# Altium schematic sheet Top_Level.SchDoc: Top Level
size 292 x 193 mm; SheetNumber: 3; SheetTotal: 11; SheetSize: A4
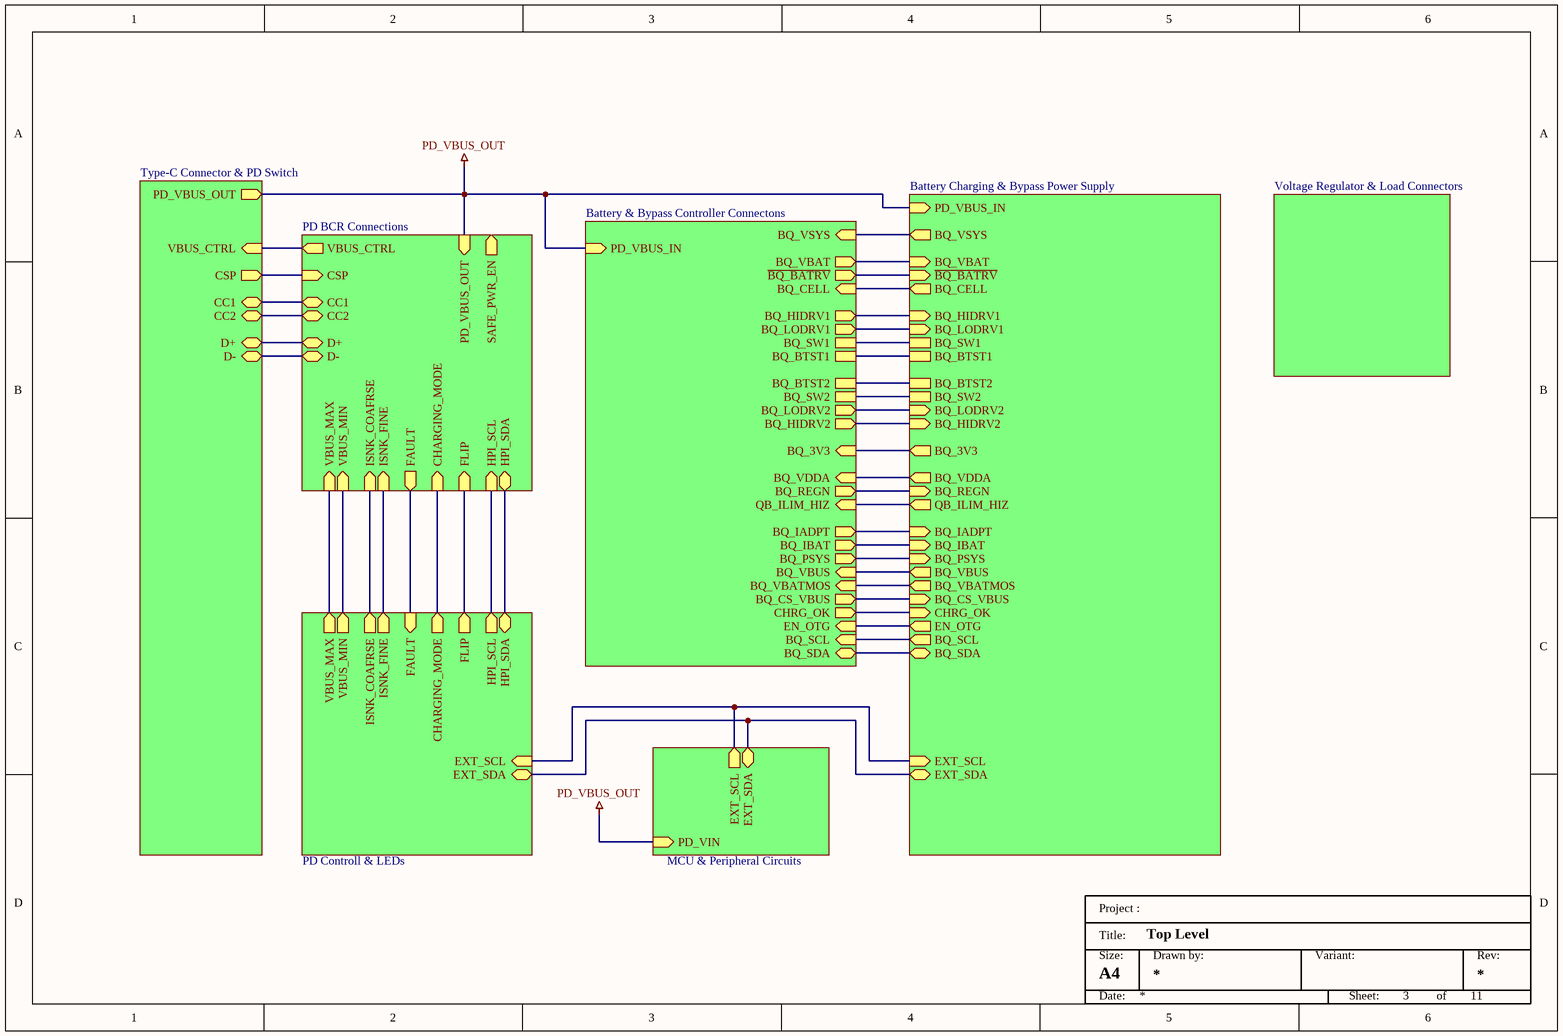
[diagram p0: Top_Level.SchDoc]

## Sub-sheets
Battery & Bypass Controller Connectons = Battery_and_Bypass_Controller_Connectons.SchDoc: CHRG_OK (out), EN_OTG (in), PD_VBUS_IN (in), BQ_3V3 (in), BQ_VDDA (in), QB_ILIM_HIZ (in), BQ_VBUS (in), BQ_IADPT (out), BQ_IBAT (out), BQ_PSYS (out), BQ_REGN (out), BQ_CS_VBUS (out), BQ_HIDRV1 (out), BQ_HIDRV2 (out), BQ_BTST1, BQ_BTST2, BQ_LODRV1 (out), BQ_LODRV2 (out), BQ_SW1, BQ_SW2, BQ_VBAT (out), ~{BQ_BATRV} (out), BQ_VBATMOS (in), BQ_CELL (in), BQ_SDA (bidir), BQ_SCL (in), BQ_VSYS (in)
Battery Charging & Bypass Power Supply = Battery_Charging_and_Bypass_Power_Supply.SchDoc: EXT_SCL (in), EXT_SDA (bidir), BQ_3V3 (out), BQ_VBAT (in), BQ_SCL (out), CHRG_OK (in), EN_OTG (out), QB_ILIM_HIZ (out), PD_VBUS_IN (in), BQ_IADPT (in), BQ_IBAT (in), BQ_PSYS (in), BQ_REGN (in), ~{BQ_BATRV} (in), BQ_VBATMOS (out), BQ_CELL (out), BQ_SDA (bidir), BQ_VDDA (out), BQ_CS_VBUS (in), BQ_HIDRV1 (in), BQ_LODRV1 (in), BQ_SW1, BQ_BTST1, BQ_BTST2, BQ_SW2, BQ_LODRV2 (in), BQ_HIDRV2 (in), BQ_VSYS (out), BQ_VBUS (out)
MCU & Peripheral Circuits = MCU_and_Peripheral_Circuits.SchDoc: EXT_SDA (bidir), PD_VIN (in), EXT_SCL (out)
PD BCR Connections = PD_BCR_Connections.SchDoc: CC1 (bidir), CC2 (bidir), CSP (in), VBUS_CTRL (out), FAULT (out), CHARGING_MODE (in), FLIP (in), VBUS_MAX (in), VBUS_MIN (in), ISNK_FINE (in), ISNK_COAFRSE (in), HPI_SCL (in), HPI_SDA (bidir), D+ (bidir), D- (bidir), PD_VBUS_OUT (in), SAFE_PWR_EN (out)
PD Controll & LEDs = PD_Controll_and_LEDs.SchDoc: CHARGING_MODE (out), EXT_SCL (in), EXT_SDA (bidir), FLIP (out), HPI_SCL (out), HPI_SDA (bidir), VBUS_MAX (out), VBUS_MIN (out), ISNK_FINE (out), ISNK_COAFRSE (out), FAULT (in)
Type-C Connector & PD Switch = Type-C_Connector_and_PD_Switch.SchDoc: D+ (bidir), D- (bidir), CC1 (bidir), CC2 (bidir), VBUS_CTRL (in), PD_VBUS_OUT (out), CSP (out)
Voltage Regulator & Load Connectors = Voltage_Regulator_and_Load_Connectors.SchDoc: no entries

## Nets
PD_VBUS_OUT: sheet MCU & Peripheral Circuits/PD_VIN, sheet Type-C Connector & PD Switch/PD_VBUS_OUT, sheet PD BCR Connections/PD_VBUS_OUT, sheet Battery & Bypass Controller Connectons/PD_VBUS_IN, sheet Battery Charging & Bypass Power Supply/PD_VBUS_IN
(unnamed): sheet PD Controll & LEDs/CHARGING_MODE, sheet PD BCR Connections/CHARGING_MODE
(unnamed): sheet PD Controll & LEDs/EXT_SCL, sheet MCU & Peripheral Circuits/EXT_SCL, sheet Battery Charging & Bypass Power Supply/EXT_SCL
(unnamed): sheet PD Controll & LEDs/EXT_SDA, sheet MCU & Peripheral Circuits/EXT_SDA, sheet Battery Charging & Bypass Power Supply/EXT_SDA
(unnamed): sheet PD Controll & LEDs/FLIP, sheet PD BCR Connections/FLIP
(unnamed): sheet PD Controll & LEDs/HPI_SCL, sheet PD BCR Connections/HPI_SCL
(unnamed): sheet PD Controll & LEDs/HPI_SDA, sheet PD BCR Connections/HPI_SDA
(unnamed): sheet PD Controll & LEDs/VBUS_MAX, sheet PD BCR Connections/VBUS_MAX
(unnamed): sheet PD Controll & LEDs/VBUS_MIN, sheet PD BCR Connections/VBUS_MIN
(unnamed): sheet PD Controll & LEDs/ISNK_FINE, sheet PD BCR Connections/ISNK_FINE
(unnamed): sheet PD Controll & LEDs/ISNK_COAFRSE, sheet PD BCR Connections/ISNK_COAFRSE
(unnamed): sheet PD Controll & LEDs/FAULT, sheet PD BCR Connections/FAULT
(unnamed): sheet Type-C Connector & PD Switch/D+, sheet PD BCR Connections/D+
(unnamed): sheet Type-C Connector & PD Switch/D-, sheet PD BCR Connections/D-
(unnamed): sheet Type-C Connector & PD Switch/CC1, sheet PD BCR Connections/CC1
(unnamed): sheet Type-C Connector & PD Switch/CC2, sheet PD BCR Connections/CC2
(unnamed): sheet Type-C Connector & PD Switch/VBUS_CTRL, sheet PD BCR Connections/VBUS_CTRL
(unnamed): sheet Type-C Connector & PD Switch/CSP, sheet PD BCR Connections/CSP
(unnamed): sheet Battery & Bypass Controller Connectons/CHRG_OK, sheet Battery Charging & Bypass Power Supply/CHRG_OK
(unnamed): sheet Battery & Bypass Controller Connectons/EN_OTG, sheet Battery Charging & Bypass Power Supply/EN_OTG
(unnamed): sheet Battery & Bypass Controller Connectons/BQ_3V3, sheet Battery Charging & Bypass Power Supply/BQ_3V3
(unnamed): sheet Battery & Bypass Controller Connectons/BQ_VDDA, sheet Battery Charging & Bypass Power Supply/BQ_VDDA
(unnamed): sheet Battery & Bypass Controller Connectons/QB_ILIM_HIZ, sheet Battery Charging & Bypass Power Supply/QB_ILIM_HIZ
(unnamed): sheet Battery & Bypass Controller Connectons/BQ_VBUS, sheet Battery Charging & Bypass Power Supply/BQ_VBUS
(unnamed): sheet Battery & Bypass Controller Connectons/BQ_IADPT, sheet Battery Charging & Bypass Power Supply/BQ_IADPT
(unnamed): sheet Battery & Bypass Controller Connectons/BQ_IBAT, sheet Battery Charging & Bypass Power Supply/BQ_IBAT
(unnamed): sheet Battery & Bypass Controller Connectons/BQ_PSYS, sheet Battery Charging & Bypass Power Supply/BQ_PSYS
(unnamed): sheet Battery & Bypass Controller Connectons/BQ_REGN, sheet Battery Charging & Bypass Power Supply/BQ_REGN
(unnamed): sheet Battery & Bypass Controller Connectons/BQ_CS_VBUS, sheet Battery Charging & Bypass Power Supply/BQ_CS_VBUS
(unnamed): sheet Battery & Bypass Controller Connectons/BQ_HIDRV1, sheet Battery Charging & Bypass Power Supply/BQ_HIDRV1
(unnamed): sheet Battery & Bypass Controller Connectons/BQ_HIDRV2, sheet Battery Charging & Bypass Power Supply/BQ_HIDRV2
(unnamed): sheet Battery & Bypass Controller Connectons/BQ_BTST1, sheet Battery Charging & Bypass Power Supply/BQ_BTST1
(unnamed): sheet Battery & Bypass Controller Connectons/BQ_BTST2, sheet Battery Charging & Bypass Power Supply/BQ_BTST2
(unnamed): sheet Battery & Bypass Controller Connectons/BQ_LODRV1, sheet Battery Charging & Bypass Power Supply/BQ_LODRV1
(unnamed): sheet Battery & Bypass Controller Connectons/BQ_LODRV2, sheet Battery Charging & Bypass Power Supply/BQ_LODRV2
(unnamed): sheet Battery & Bypass Controller Connectons/BQ_SW1, sheet Battery Charging & Bypass Power Supply/BQ_SW1
(unnamed): sheet Battery & Bypass Controller Connectons/BQ_SW2, sheet Battery Charging & Bypass Power Supply/BQ_SW2
(unnamed): sheet Battery & Bypass Controller Connectons/BQ_VBAT, sheet Battery Charging & Bypass Power Supply/BQ_VBAT
(unnamed): sheet Battery & Bypass Controller Connectons/~{BQ_BATRV}, sheet Battery Charging & Bypass Power Supply/~{BQ_BATRV}
(unnamed): sheet Battery & Bypass Controller Connectons/BQ_VBATMOS, sheet Battery Charging & Bypass Power Supply/BQ_VBATMOS
(unnamed): sheet Battery & Bypass Controller Connectons/BQ_CELL, sheet Battery Charging & Bypass Power Supply/BQ_CELL
(unnamed): sheet Battery & Bypass Controller Connectons/BQ_SDA, sheet Battery Charging & Bypass Power Supply/BQ_SDA
(unnamed): sheet Battery & Bypass Controller Connectons/BQ_SCL, sheet Battery Charging & Bypass Power Supply/BQ_SCL
(unnamed): sheet Battery & Bypass Controller Connectons/BQ_VSYS, sheet Battery Charging & Bypass Power Supply/BQ_VSYS

## Notes on the sheet
- Project :
- Size:
- Title:
- Drawn by:
- Variant:
- Rev:
- Date:
- Sheet:
- of